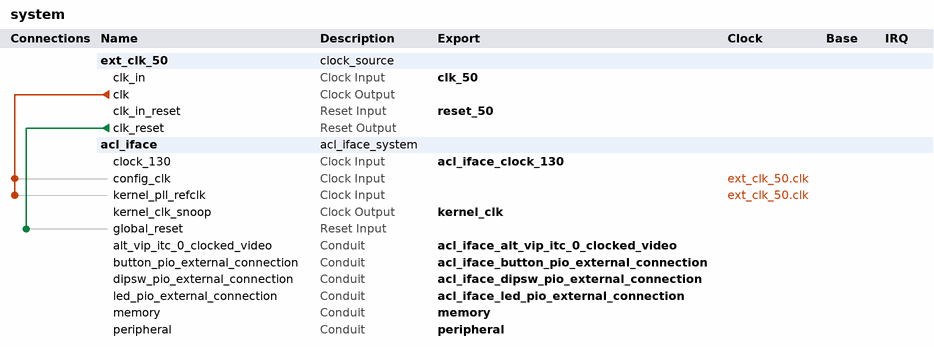
[diagram p0: system contents]
# Platform Designer (Qsys) system system, Cyclone V 5CSEBA6U23I7
# Parameters at their usual value, and those the tool derives, are not listed.
package require -exact qsys 16.1
create_system system
set_project_property DEVICE_FAMILY {Cyclone V}
set_project_property DEVICE 5CSEBA6U23I7

add_instance ext_clk_50 clock_source 16.1
set_instance_parameter_value ext_clk_50 clockFrequency 50000000

add_instance acl_iface acl_iface_system 1.0

# connections
add_connection ext_clk_50.clk acl_iface.config_clk clock
add_connection ext_clk_50.clk acl_iface.kernel_pll_refclk clock
add_connection ext_clk_50.clk_reset acl_iface.global_reset reset

# exported interfaces
add_interface acl_iface_alt_vip_itc_0_clocked_video conduit end
set_interface_property acl_iface_alt_vip_itc_0_clocked_video EXPORT_OF acl_iface.alt_vip_itc_0_clocked_video
add_interface acl_iface_button_pio_external_connection conduit end
set_interface_property acl_iface_button_pio_external_connection EXPORT_OF acl_iface.button_pio_external_connection
add_interface acl_iface_clock_130 clock sink
set_interface_property acl_iface_clock_130 EXPORT_OF acl_iface.clock_130
add_interface acl_iface_dipsw_pio_external_connection conduit end
set_interface_property acl_iface_dipsw_pio_external_connection EXPORT_OF acl_iface.dipsw_pio_external_connection
add_interface acl_iface_led_pio_external_connection conduit end
set_interface_property acl_iface_led_pio_external_connection EXPORT_OF acl_iface.led_pio_external_connection
add_interface clk_50 clock sink
set_interface_property clk_50 EXPORT_OF ext_clk_50.clk_in
add_interface kernel_clk clock source
set_interface_property kernel_clk EXPORT_OF acl_iface.kernel_clk_snoop
add_interface memory conduit end
set_interface_property memory EXPORT_OF acl_iface.memory
add_interface peripheral conduit end
set_interface_property peripheral EXPORT_OF acl_iface.peripheral
add_interface reset_50 reset sink
set_interface_property reset_50 EXPORT_OF ext_clk_50.clk_in_reset

set_interconnect_requirement {$system} qsys_mm.clockCrossingAdapter FIFO
set_interconnect_requirement {$system} qsys_mm.maxAdditionalLatency 0

save_system system.qsys
